# Altium schematic sheet Connector_DAC_Side.SchDoc
size B; SheetNumber: 3; SheetTotal: 15
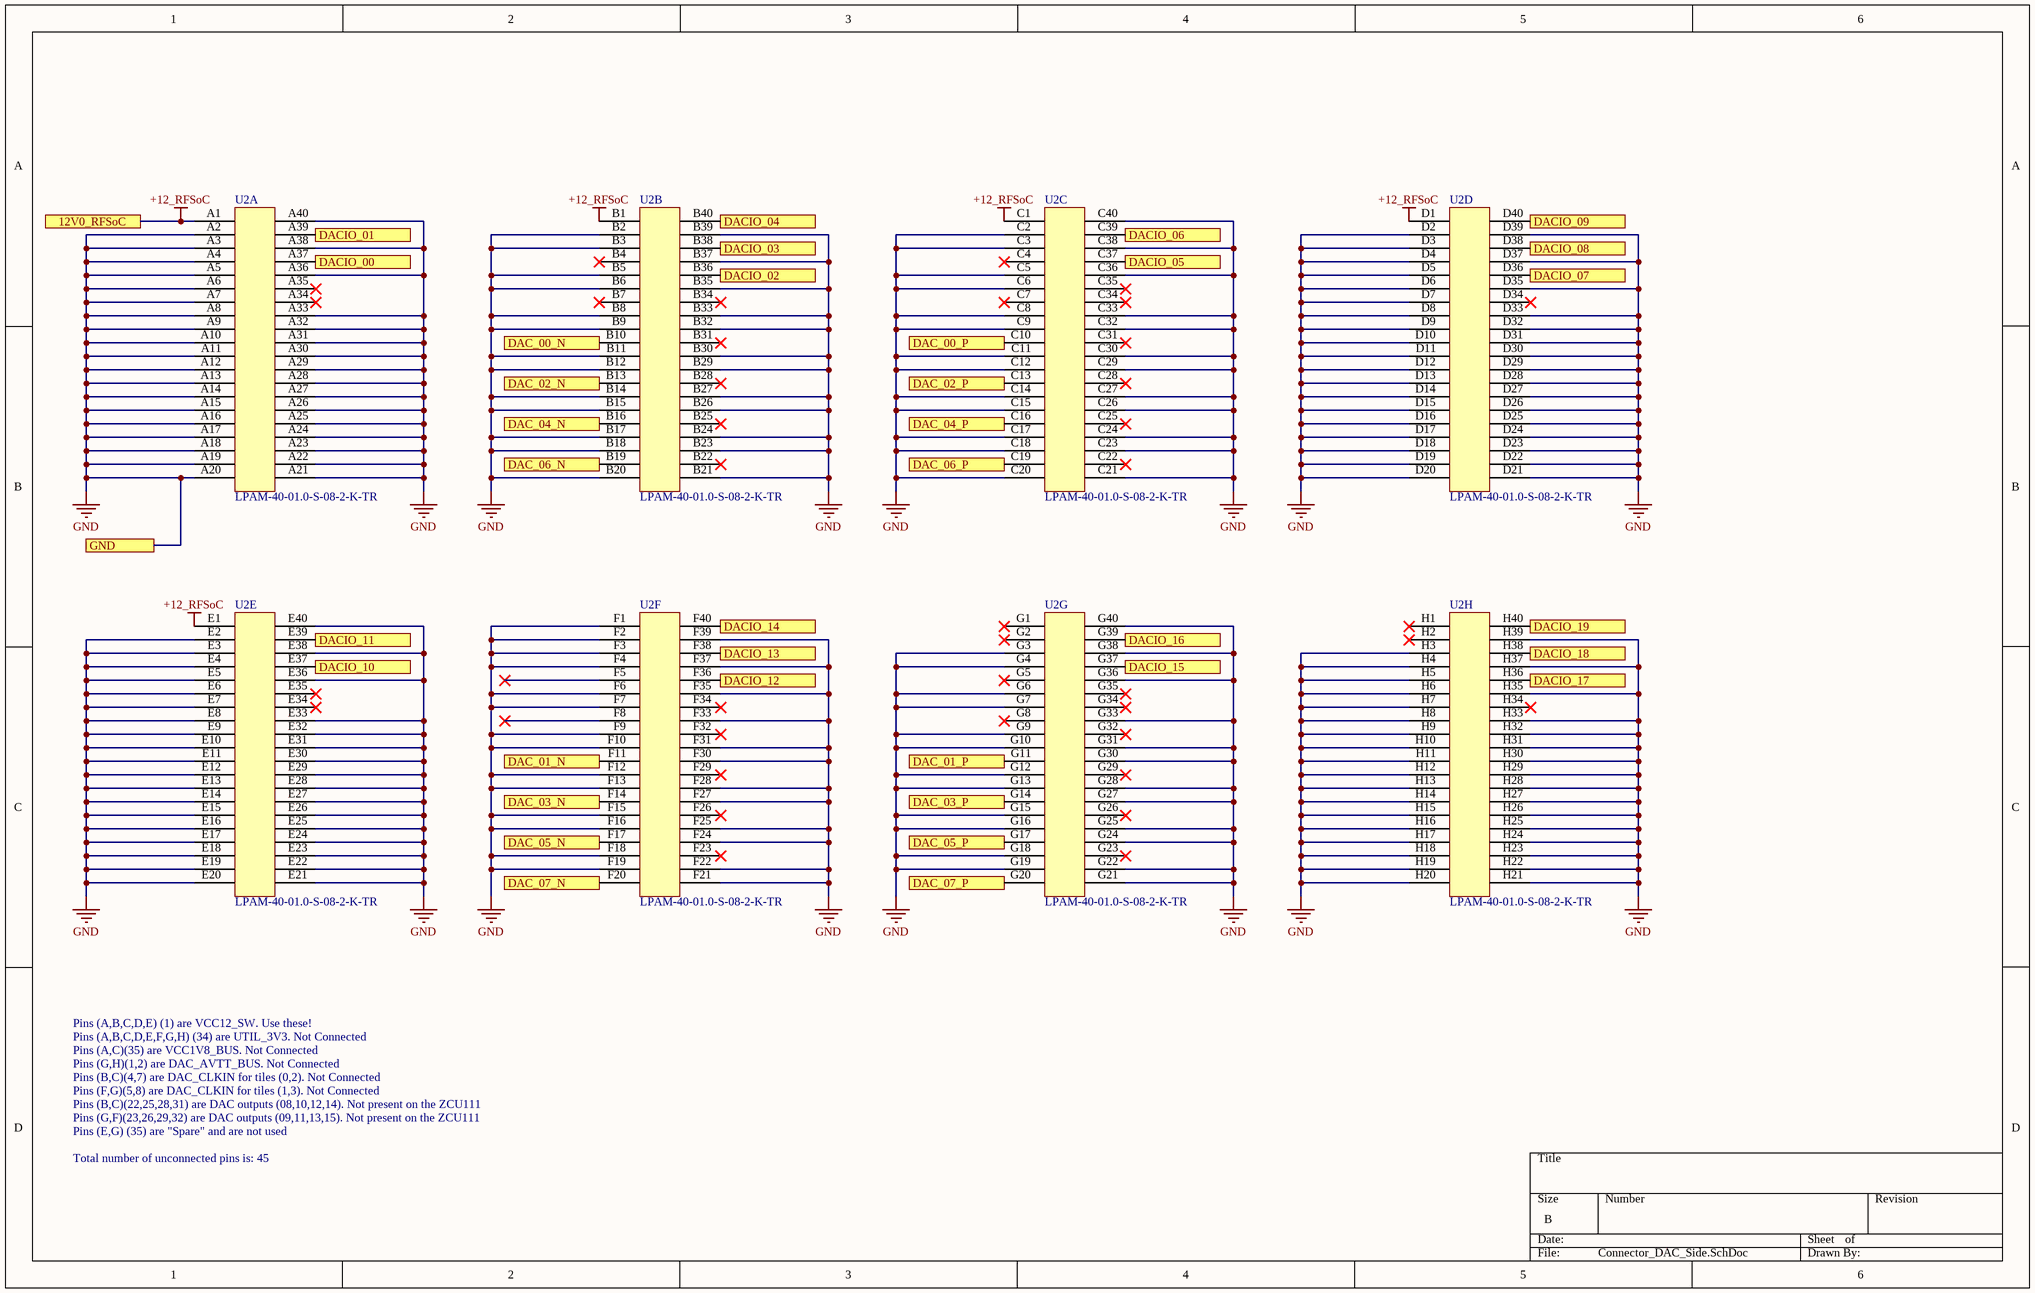
[diagram p0: Connector_DAC_Side.SchDoc]

## Parts
U2  LPAM-40-01.0-S-08-2-K-TR  [LPAM-40-01.5-S-08-2-K-TR]  (parts A,B,C,D,E,F,G,H of 8)

## Ports
12V0_RFSoC, DAC_00_N, DAC_00_P, DAC_01_N, DAC_01_P, DAC_02_N, DAC_02_P, DAC_03_N, DAC_03_P, DAC_04_N, DAC_04_P, DAC_05_N, DAC_05_P, DAC_06_N, DAC_06_P, DAC_07_N, DAC_07_P, DACIO_00, DACIO_01, DACIO_02, DACIO_03, DACIO_04, DACIO_05, DACIO_06, DACIO_07, DACIO_08, DACIO_09, DACIO_10, DACIO_11, DACIO_12, DACIO_13, DACIO_14, DACIO_15, DACIO_16, DACIO_17, DACIO_18, DACIO_19, GND

## Nets
+12_RFSoC: U2.A1 U2.B1 U2.C1 U2.D1 U2.E1 ; port 12V0_RFSoC
GND: U2.A2 U2.A3 U2.A4 U2.A5 U2.A6 U2.A7 U2.A8 U2.A9 U2.A10 U2.A11 U2.A12 U2.A13 U2.A14 U2.A15 U2.A16 U2.A17 U2.A18 U2.A19 U2.A20 U2.A21 U2.A22 U2.A23 U2.A24 U2.A25 U2.A26 U2.A27 U2.A28 U2.A29 U2.A30 U2.A31 U2.A32 U2.A33 U2.A36 U2.A38 U2.A40 U2.B2 U2.B3 U2.B5 U2.B6 U2.B8 U2.B9 U2.B11 U2.B12 U2.B14 U2.B15 U2.B17 U2.B18 U2.B20 U2.B21 U2.B23 U2.B24 U2.B26 U2.B27 U2.B29 U2.B30 U2.B32 U2.B33 U2.B35 U2.B37 U2.B39 U2.C2 U2.C3 U2.C5 U2.C6 U2.C8 U2.C9 U2.C11 U2.C12 U2.C14 U2.C15 U2.C17 U2.C18 U2.C20 U2.C21 U2.C23 U2.C24 U2.C26 U2.C27 U2.C29 U2.C30 U2.C32 U2.C33 U2.C36 U2.C38 U2.C40 U2.D2 U2.D3 U2.D4 U2.D5 U2.D6 U2.D7 U2.D8 U2.D9 U2.D10 U2.D11 U2.D12 U2.D13 U2.D14 U2.D15 U2.D16 U2.D17 U2.D18 U2.D19 U2.D20 U2.D21 U2.D22 U2.D23 U2.D24 U2.D25 U2.D26 U2.D27 U2.D28 U2.D29 U2.D30 U2.D31 U2.D32 U2.D33 U2.D35 U2.D37 U2.D39 U2.E2 U2.E3 U2.E4 U2.E5 U2.E6 U2.E7 U2.E8 U2.E9 U2.E10 U2.E11 U2.E12 U2.E13 U2.E14 U2.E15 U2.E16 U2.E17 U2.E18 U2.E19 U2.E20 U2.E21 U2.E22 U2.E23 U2.E24 U2.E25 U2.E26 U2.E27 U2.E28 U2.E29 U2.E30 U2.E31 U2.E32 U2.E33 U2.E36 U2.E38 U2.E40 U2.F1 U2.F2 U2.F3 U2.F4 U2.F6 U2.F7 U2.F9 U2.F10 U2.F12 U2.F13 U2.F15 U2.F16 U2.F18 U2.F19 U2.F21 U2.F22 U2.F24 U2.F25 U2.F27 U2.F28 U2.F30 U2.F31 U2.F33 U2.F35 U2.F37 U2.F39 U2.G3 U2.G4 U2.G6 U2.G7 U2.G9 U2.G10 U2.G12 U2.G13 U2.G15 U2.G16 U2.G18 U2.G19 U2.G21 U2.G22 U2.G24 U2.G25 U2.G27 U2.G28 U2.G30 U2.G31 U2.G33 U2.G36 U2.G38 U2.G40 U2.H3 U2.H4 U2.H5 U2.H6 U2.H7 U2.H8 U2.H9 U2.H10 U2.H11 U2.H12 U2.H13 U2.H14 U2.H15 U2.H16 U2.H17 U2.H18 U2.H19 U2.H20 U2.H21 U2.H22 U2.H23 U2.H24 U2.H25 U2.H26 U2.H27 U2.H28 U2.H29 U2.H30 U2.H31 U2.H32 U2.H33 U2.H35 U2.H37 U2.H39 ; port GND
DAC_00_N: U2.B10 ; port DAC_00_N
DAC_00_P: U2.C10 ; port DAC_00_P
DAC_01_N: U2.F11 ; port DAC_01_N
DAC_01_P: U2.G11 ; port DAC_01_P
DAC_02_N: U2.B13 ; port DAC_02_N
DAC_02_P: U2.C13 ; port DAC_02_P
DAC_03_N: U2.F14 ; port DAC_03_N
DAC_03_P: U2.G14 ; port DAC_03_P
DAC_04_N: U2.B16 ; port DAC_04_N
DAC_04_P: U2.C16 ; port DAC_04_P
DAC_05_N: U2.F17 ; port DAC_05_N
DAC_05_P: U2.G17 ; port DAC_05_P
DAC_06_N: U2.B19 ; port DAC_06_N
DAC_06_P: U2.C19 ; port DAC_06_P
DAC_07_N: U2.F20 ; port DAC_07_N
DAC_07_P: U2.G20 ; port DAC_07_P
DACIO_00: U2.A37 ; port DACIO_00
DACIO_01: U2.A39 ; port DACIO_01
DACIO_02: U2.B36 ; port DACIO_02
DACIO_03: U2.B38 ; port DACIO_03
DACIO_04: U2.B40 ; port DACIO_04
DACIO_05: U2.C37 ; port DACIO_05
DACIO_06: U2.C39 ; port DACIO_06
DACIO_07: U2.D36 ; port DACIO_07
DACIO_08: U2.D38 ; port DACIO_08
DACIO_09: U2.D40 ; port DACIO_09
DACIO_10: U2.E37 ; port DACIO_10
DACIO_11: U2.E39 ; port DACIO_11
DACIO_12: U2.F36 ; port DACIO_12
DACIO_13: U2.F38 ; port DACIO_13
DACIO_14: U2.F40 ; port DACIO_14
DACIO_15: U2.G37 ; port DACIO_15
DACIO_16: U2.G39 ; port DACIO_16
DACIO_17: U2.H36 ; port DACIO_17
DACIO_18: U2.H38 ; port DACIO_18
DACIO_19: U2.H40 ; port DACIO_19

Not connected (* = marked no-connect by the designer): U2 A34* A35* B4* B7* B22* B25* B28* B31* B34* C4* C7* C22* C25* C28* C31* C34* C35* D34* E34* E35* F5* F8* F23* F26* F29* F32* F34* G1* G2* G5* G8* G23* G26* G29* G32* G34* G35* H1* H2* H34*

## Notes on the sheet
- Pins (A,B,C,D,E) (1) are VCC12_SW. Use these!
- Pins (A,B,C,D,E,F,G,H) (34) are UTIL_3V3. Not Connected
- Pins (A,C)(35) are VCC1V8_BUS. Not Connected
- Pins (G,H)(1,2) are DAC_AVTT_BUS. Not Connected
- Pins (B,C)(4,7) are DAC_CLKIN for tiles (0,2). Not Connected
- Pins (F,G)(5,8) are DAC_CLKIN for tiles (1,3). Not Connected
- Pins (B,C)(22,25,28,31) are DAC outputs (08,10,12,14). Not present on the ZCU111
- Pins (G,F)(23,26,29,32) are DAC outputs (09,11,13,15). Not present on the ZCU111
- Total number of unconnected pins is: 45
- Pins (E,G) (35) are "Spare" and are not used

## Library data of the parts
U2 = LPAM-40-01.5-S-08-2-K-TR: .050" LP Array™ High-Speed High-Density Low Profile Open-Pin-Field Array, Terminal